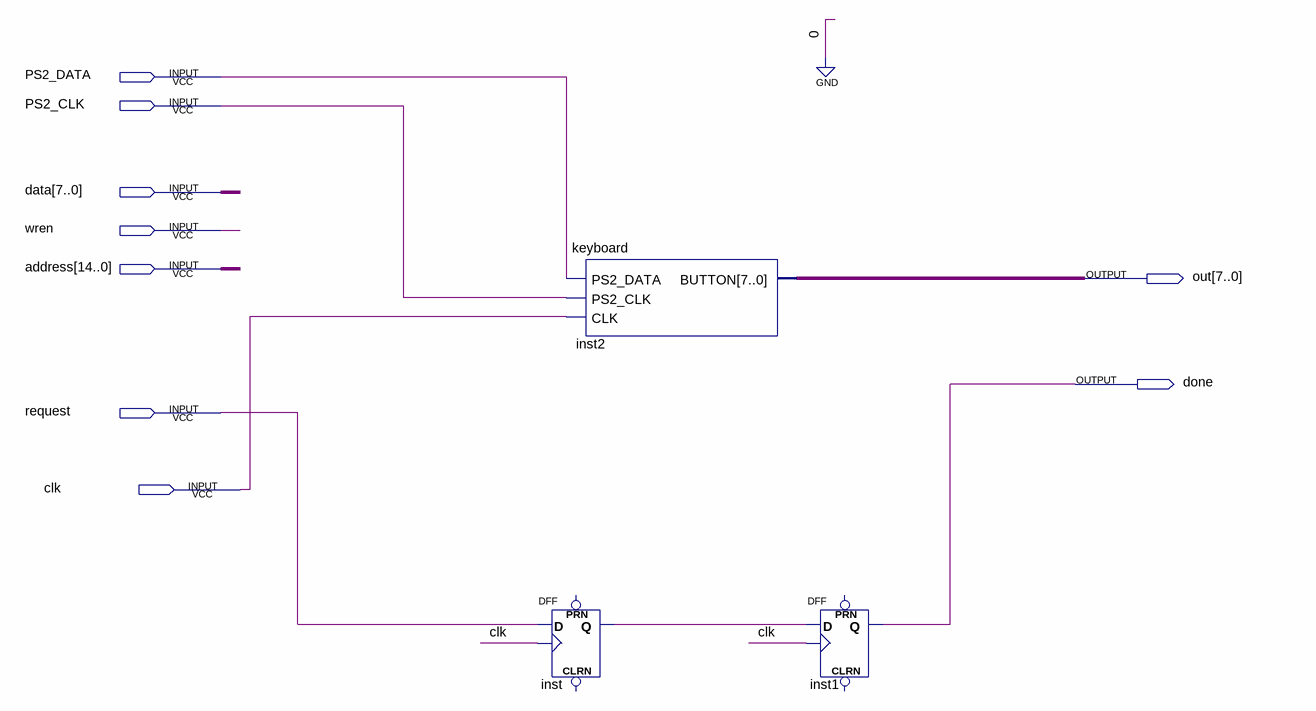
[diagram p0: schematic sheet]
// Quartus schematic PS2RAM.bdf as structural Verilog: 3 symbols, 9 pins
module PS2RAM (
  input  PS2_DATA,
  input  PS2_CLK,
  input  [7:0] data,
  input  wren,
  input  [14:0] address,
  input  request,
  input  clk,
  output [7:0] out,
  output done
);

  wire inst_q;

  DFF inst (.CLK(clk), .D(request), .Q(inst_q));  // open: CLRN, PRN
  keyboard inst2 (.PS2_DATA(PS2_DATA), .PS2_CLK(PS2_CLK), .CLK(clk), .BUTTON(out));
  DFF inst1 (.CLK(clk), .D(inst_q), .Q(done));  // open: CLRN, PRN
endmodule
